# EAGLE board ecg_2017 (EAGLE 7.6.0)
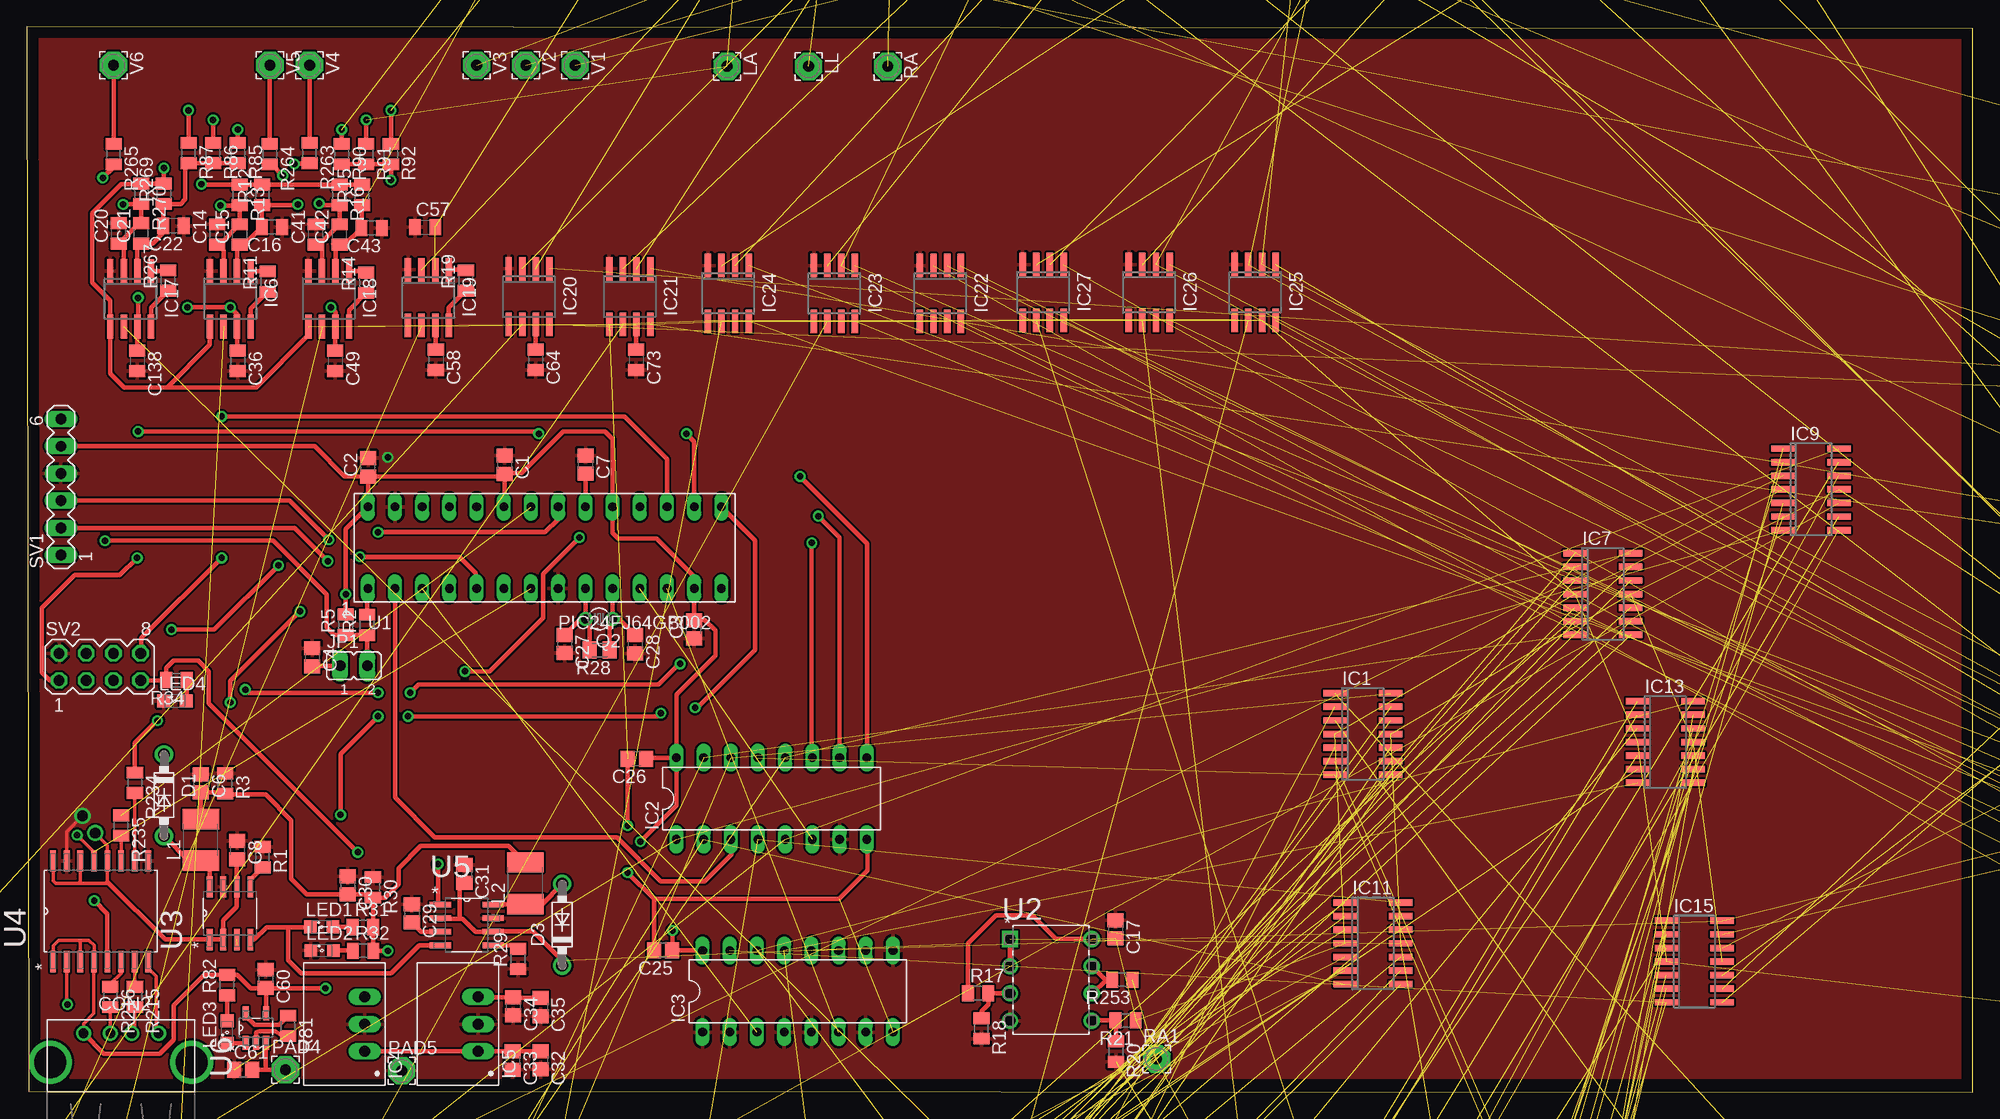
[diagram p5: board, top side]
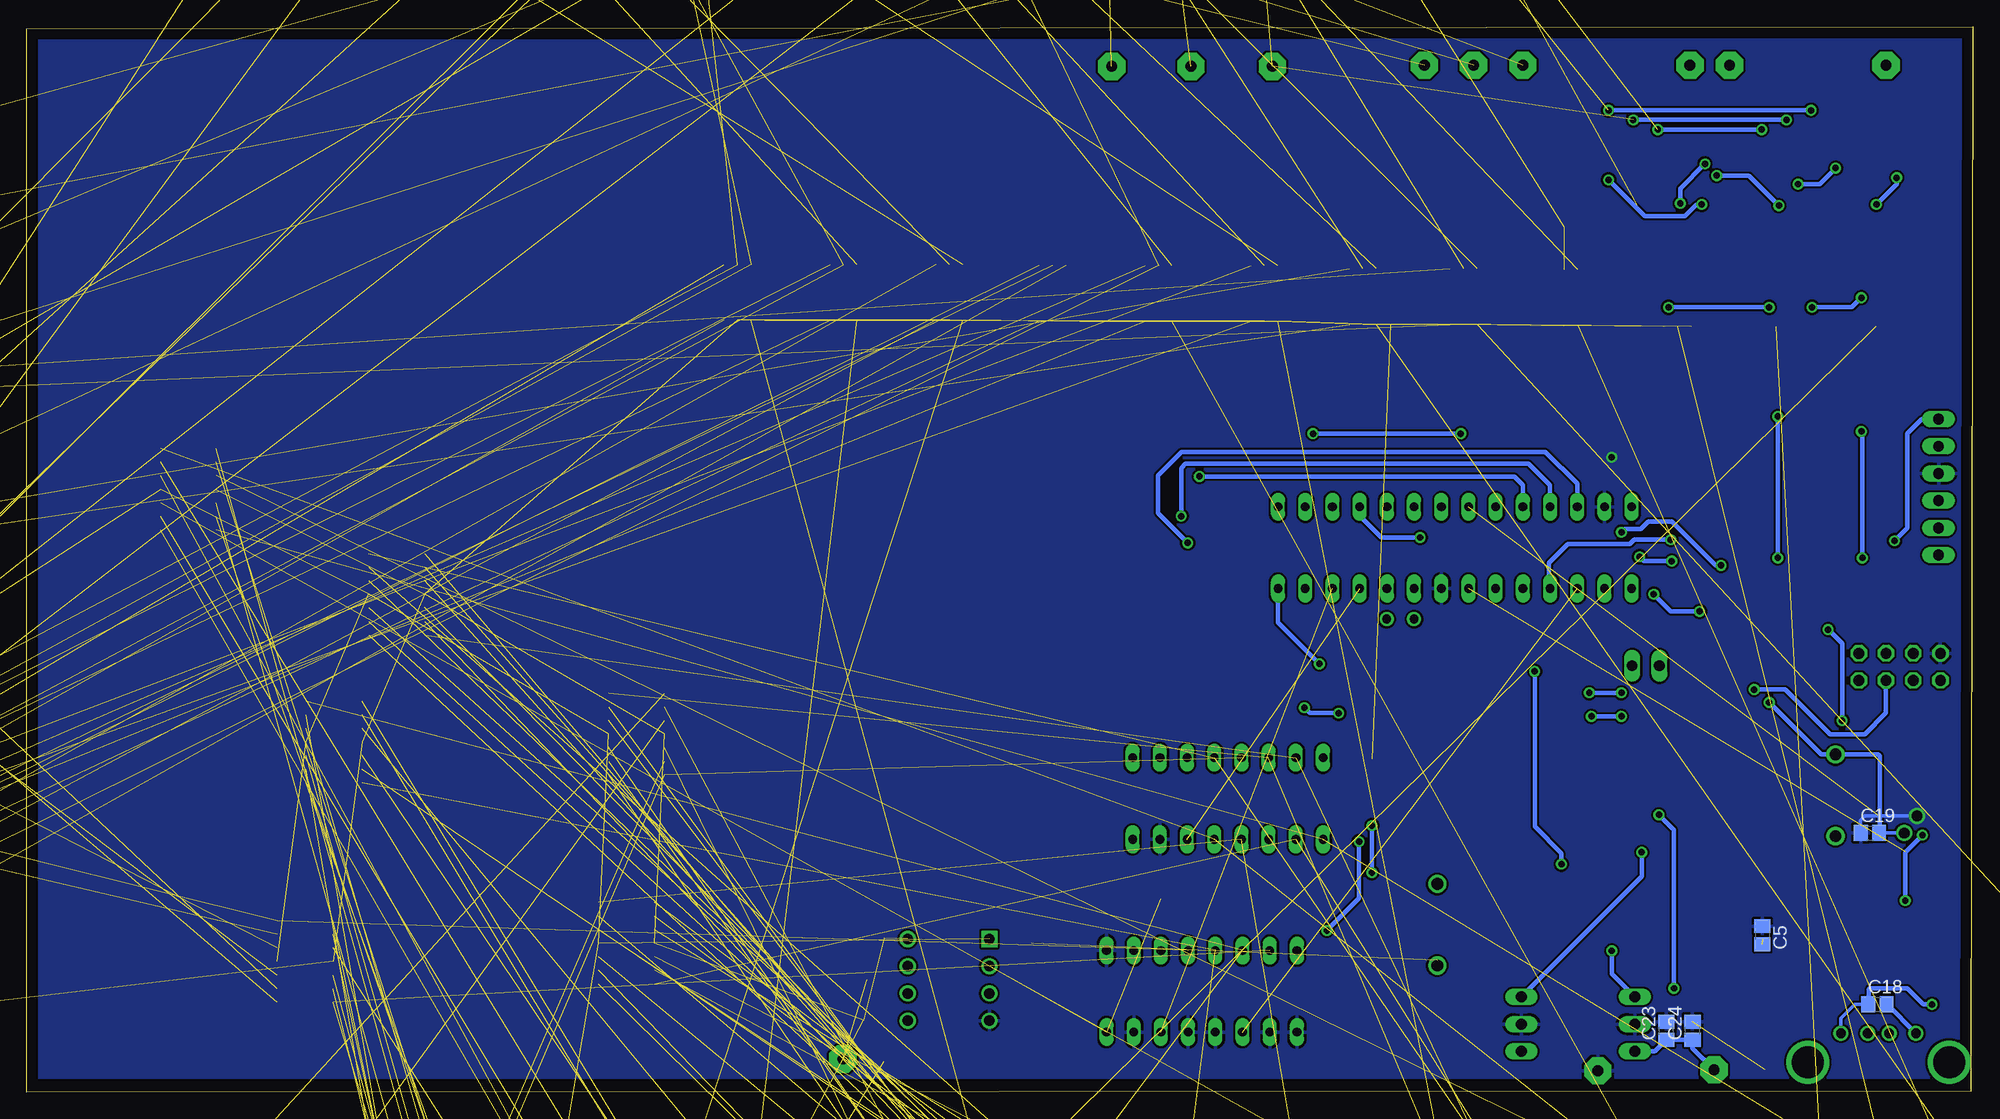
[diagram p6: board, bottom side, seen from below]

Size 181.7 x 99.5 mm. Coordinates in mm from the lower left corner, seen from the top.
Outline: 0.2,0.1 181.7,0 181.7,99.3 0,99.5 0.2,0.1
Copper layers (1*16): Top 0.035mm / dielectric 1.5mm / Bottom 0.035mm
Design rules "default": minimum track width 10mil, minimum drill 24mil, track to track 8mil, track to pad 8mil, pad to pad 8mil, via to via 8mil, smd to smd 8mil, copper to edge 40mil, drill to drill 8mil, minimum pad ring 10mil, minimum via ring 8mil, stop-mask expansion 4mil, vias tented up to drill 0mil, thermal gap 10mil

## Footprints (pad centres in the part's own frame; a part is rotated, then mirrored left to right if it is on the bottom)
C0805 = smd 1.3 x 1.5: 1 -0.85,0; 2 0.85,0
C0805' = smd 1.1 x 1.5: 1 -0.95,0; 2 0.95,0
USB-FEMALE-A-PTH = drill 0.9: D+ 5.9,1.3; D- 7.9,1.3; GND 3.4,1.3; VBUS 10.4,1.3 | drill 3: GND@1 13.5,4; GND@2 0.3,4
DO41-7.6 = drill 1.1 pad 1.7: A 3.81,0; C -3.81,0
SO14 = smd 0.6 x 2.2: 1 -3.81,-2.6; 2 -2.54,-2.6; 3 -1.27,-2.6; 4 0,-2.6; 5 1.27,-2.6; 6 2.54,-2.6; 7 3.81,-2.6; 8 3.81,2.6; 9 2.54,2.6; 10 1.27,2.6; 11 0,2.6; 12 -1.27,2.6; 13 -2.54,2.6; 14 -3.81,2.6
DIL16 = drill 0.813 long: 1 -8.89,-3.81; 2 -6.35,-3.81; 3 -3.81,-3.81; 4 -1.27,-3.81; 5 1.27,-3.81; 6 3.81,-3.81; 7 6.35,-3.81; 8 8.89,-3.81; 9 8.89,3.81; 10 6.35,3.81; 11 3.81,3.81; 12 1.27,3.81; 13 -1.27,3.81; 14 -3.81,3.81; 15 -6.35,3.81; 16 -8.89,3.81
R-78XX = drill 1.016 long: GND 0,-2.54; IN -2.54,-2.54; OUT 2.54,-2.54
SO8 = smd 0.6 x 2.2: 1 -1.905,-2.6; 2 -0.635,-2.6; 3 0.635,-2.6; 4 1.905,-2.6; 5 1.905,2.6; 6 0.635,2.6; 7 -0.635,2.6; 8 -1.905,2.6
JP2 = drill 1 long: 1 -1.27,0; 2 1.27,0
L1812 = smd 1.9 x 3.4: 1 -1.95,0; 2 1.95,0
2,54/1,0 = drill 1.016 pad 2.54 octagon: 1 0,0
SML0805 = smd 1.2 x 1.2: A 1.05,0; C -1.05,0
TC26V = drill 0.813: 1 -1.27,0; 2 1.27,0
R0805 = smd 1.1 x 1.5: 1 -0.95,0; 2 0.95,0
M0805 = smd 1.3 x 1.6: 1 -0.95,0; 2 0.95,0
MA06-1 = drill 1.016 long: 1 -6.35,0; 2 -3.81,0; 3 -1.27,0; 4 1.27,0; 5 3.81,0; 6 6.35,0
MA04-2 = drill 1.016 octagon: 1 -3.81,-1.27; 2 -3.81,1.27; 3 -1.27,-1.27; 4 -1.27,1.27; 5 1.27,-1.27; 6 1.27,1.27; 7 3.81,-1.27; 8 3.81,1.27
DIP28 = drill 0.813 long: 1 0,33.02; 2 0,30.48; 3 0,27.94; 4 0,25.4; 5 0,22.86; 6 0,20.32; 7 0,17.78; 8 0,15.24; 9 0,12.7; 10 0,10.16; 11 0,7.62; 12 0,5.08; 13 0,2.54; 14 0,0; 15 7.62,0; 16 7.62,2.54; 17 7.62,5.08; 18 7.62,7.62; 19 7.62,10.16; 20 7.62,12.7; 21 7.62,15.24; 22 7.62,17.78; 23 7.62,20.32; 24 7.62,22.86; 25 7.62,25.4; 26 7.62,27.94; 27 7.62,30.48; 28 7.62,33.02
DIP254P762X533-8 = drill 0.991 square: 1 -7.62,7.62 | drill 0.991: 2 -7.62,5.08; 3 -7.62,2.54; 4 -7.62,0; 5 0,0; 6 0,2.54; 7 0,5.08; 8 0,7.62
SOIC127P600X175-8N = smd 1.981 x 0.533: 1 -2.464,1.905; 2 -2.464,0.635; 3 -2.464,-0.635; 4 -2.464,-1.905; 5 2.464,-1.905; 6 2.464,-0.635; 7 2.464,0.635; 8 2.464,1.905
SOIC127P1032X265-16N = smd 1.981 x 0.533: 1 -4.699,4.445; 2 -4.699,3.175; 3 -4.699,1.905; 4 -4.699,0.635; 5 -4.699,-0.635; 6 -4.699,-1.905; 7 -4.699,-3.175; 8 -4.699,-4.445; 9 4.699,-4.445; 10 4.699,-3.175; 11 4.699,-1.905; 12 4.699,-0.635; 13 4.699,0.635; 14 4.699,1.905; 15 4.699,3.175; 16 4.699,4.445
SOT95P300X145-5N = smd 1.321 x 0.559: 1 -1.372,0.94; 2 -1.372,0; 3 -1.372,-0.94; 4 1.372,-0.94; 5 1.372,0.94

## Placement (x,y rotation side)
C1  100n  [C0805]  44.61,58.59 270 top
C2  100n  [C0805]  31.89,58.36 90 top
C3  100n  [C0805]  62.29,43.21 90 top
C4  100n  [C0805]  26.66,40.61 270 top
C5  100n  [C0805]  19.64,14.66 270 bottom
C6  22u  [C0805]  16.26,28.83 270 top
C7  100n  [C0805]  52.16,58.61 270 top
C8  22u  [C0805]  19.66,22.61 270 top
C9  100n  [C0805]  160.96,-81.34 270 top  (outside the outline)
C10  10u  [C0805]  167.31,-90.23 270 top  (outside the outline)
C11  10u  [C0805]  167.31,-85.15 270 top  (outside the outline)
C12  1u  [C0805]  68.59,-77.23 90 top  (outside the outline)
C13  1u  [C0805]  167.31,-74.99 270 top  (outside the outline)
C14  1n  [C0805']  17.8,80.1 90 top
C15  10n  [C0805']  19.9,80.1 90 top
C16  1n  [C0805']  22.9,80.8 180 top
C17  100n  [C0805]  101.66,15.21 270 top
C18  100n  [C0805]  8.9,8.2 0 bottom
C19  100n  [C0805]  9.6,24.2 0 bottom
C20  1n  [C0805']  8.6,80.2 90 top
C21  10n  [C0805']  10.7,80.2 90 top
C22  1n  [C0805']  13.7,80.9 180 top
C23  10u  [C0805]  28.61,5.73 90 bottom
C24  100n  [C0805]  26.16,5.74 90 bottom
C25  100n  [C0805]  59.41,13.24 180 top
C26  100n  [C0805]  56.96,31.14 180 top
C27  22p  [C0805]  50.21,41.85 270 top
C28  22p  [C0805]  56.81,41.83 270 top
C29  100n  [C0805]  35.96,16.71 270 top
C30  22u  [C0805]  29.96,19.31 270 top
C31  22u  [C0805]  40.86,20.39 270 top
C32  10u  [C0805]  47.96,2.97 270 top
C33  100n  [C0805]  45.36,2.96 270 top
C34  100n  [C0805]  45.41,8.01 270 top
C35  10u  [C0805]  47.96,7.95 270 top
C36  100n  [C0805']  19.7,68.3 270 top
C37  10u  [C0805]  6.67,-142.27 270 top  (outside the outline)
C38  10u  [C0805]  6.67,-147.35 270 top  (outside the outline)
C39  1u  [C0805]  6.67,-152.43 270 top  (outside the outline)
C40  1u  [C0805]  6.67,-157.51 270 top  (outside the outline)
C41  1n  [C0805']  27,80.1 90 top
C42  10n  [C0805']  29.2,80.1 90 top
C43  1n  [C0805']  32.2,80.7 180 top
C44  100n  [C0805]  -16.19,-163.86 270 top  (outside the outline)
C45  10u  [C0805]  -26.35,-142.27 270 top  (outside the outline)
C46  10u  [C0805]  -26.35,-147.35 270 top  (outside the outline)
C47  1u  [C0805]  -26.35,-152.43 270 top  (outside the outline)
C48  1u  [C0805]  -26.35,-157.51 270 top  (outside the outline)
C49  100n  [C0805']  28.8,68.3 270 top
C50  1n  [C0805']  253.6,70.6 0 top  (outside the outline)
C51  10n  [C0805']  258.4,70.6 0 top  (outside the outline)
C53  10u  [C0805]  -59.37,-142.27 270 top  (outside the outline)
C54  10u  [C0805]  -59.37,-147.35 270 top  (outside the outline)
C55  1u  [C0805]  -59.37,-152.43 270 top  (outside the outline)
C56  1u  [C0805]  -59.37,-157.51 270 top  (outside the outline)
C57  1n  [C0805']  37.2,80.8 0 top
C58  100n  [C0805']  38.2,68.4 270 top
C59  1n  [C0805']  253.6,50.1 0 top  (outside the outline)
C60  4u7  [C0805]  22.3,10.6 270 top
C61  4u7  [C0805]  20.2,2.1 0 top
C62  10n  [C0805']  258.4,50.1 0 top  (outside the outline)
C63  1n  [C0805']  248.6,46.2 0 top  (outside the outline)
C64  100n  [C0805']  47.5,68.4 270 top
C65  1n  [C0805']  253.6,29.6 0 top  (outside the outline)
C66  100n  [C0805]  131.9,-94.9 270 top  (outside the outline)
C67  10u  [C0805]  -70.5,-59 90 top  (outside the outline)
C68  10u  [C0805]  -70.5,-54.3 90 top  (outside the outline)
C69  1u  [C0805]  -70.5,-49.6 90 top  (outside the outline)
C70  1u  [C0805]  -70.5,-44.9 90 top  (outside the outline)
C71  10n  [C0805']  258.4,29.6 0 top  (outside the outline)
C72  1n  [C0805']  248.6,25.7 0 top  (outside the outline)
C73  100n  [C0805']  56.9,68.4 270 top
C74  1n  [C0805']  278.6,-11.4 0 top  (outside the outline)
C76  10u  [C0805]  -33.3,-59 90 top  (outside the outline)
C77  10u  [C0805]  -33.3,-54.3 90 top  (outside the outline)
C78  1u  [C0805]  -33.3,-49.6 90 top  (outside the outline)
C79  1u  [C0805]  -33.3,-44.9 90 top  (outside the outline)
C80  10n  [C0805']  248.6,-15.3 0 top  (outside the outline)
C81  1n  [C0805']  253.4,-15.3 0 top  (outside the outline)
C82  100n  [C0805']  268.6,-11.4 0 top  (outside the outline)
C83  1n  [C0805']  258.2,-15.3 0 top  (outside the outline)
C84  100n  [C0805]  57.5,-94.9 270 top  (outside the outline)
C85  10u  [C0805]  3.9,-59 90 top  (outside the outline)
C86  10u  [C0805]  3.9,-54.3 90 top  (outside the outline)
C87  1u  [C0805]  3.9,-49.6 90 top  (outside the outline)
C88  1u  [C0805]  3.9,-44.9 90 top  (outside the outline)
C89  10n  [C0805']  263,-15.3 0 top  (outside the outline)
C90  1n  [C0805']  267.8,-15.3 0 top  (outside the outline)
C91  100n  [C0805']  273.6,-11.4 0 top  (outside the outline)
C92  1n  [C0805']  272.6,-15.3 0 top  (outside the outline)
C94  10u  [C0805]  41.1,-53.2 90 top  (outside the outline)
C95  10u  [C0805]  41.1,-48.5 90 top  (outside the outline)
C96  1u  [C0805]  41.1,-43.8 90 top  (outside the outline)
C97  1u  [C0805]  14.7,-94.9 270 top  (outside the outline)
C98  10n  [C0805']  277.4,-15.3 0 top  (outside the outline)
C99  1n  [C0805']  248.6,-19.2 0 top  (outside the outline)
C100  100n  [C0805']  278.3,13 0 top  (outside the outline)
C101  1n  [C0805']  248.6,4.2 0 top  (outside the outline)
C102  100n  [C0805]  -12.7,-109.7 270 top  (outside the outline)
C103  10u  [C0805]  -16.9,-100.6 270 top  (outside the outline)
C104  10u  [C0805]  78.3,-58.8 90 top  (outside the outline)
C105  1u  [C0805]  78.3,-53.1 90 top  (outside the outline)
C106  1u  [C0805]  78.3,-47.4 90 top  (outside the outline)
C107  10n  [C0805']  254.4,4.2 0 top  (outside the outline)
C108  1n  [C0805']  260.2,4.2 0 top  (outside the outline)
C109  100n  [C0805']  266,4.2 0 top  (outside the outline)
C110  1n  [C0805']  271.8,4.2 0 top  (outside the outline)
C112  10u  [C0805]  115.5,-27.8 90 top  (outside the outline)
C113  10u  [C0805]  115.5,-22.1 90 top  (outside the outline)
C114  1u  [C0805]  125.7,-70.2 90 top  (outside the outline)
C115  1u  [C0805]  125.7,-64.5 90 top  (outside the outline)
C116  10n  [C0805']  277.6,4.2 0 top  (outside the outline)
C117  1n  [C0805']  248.6,0.3 0 top  (outside the outline)
C118  100n  [C0805']  254.4,0.3 0 top  (outside the outline)
C119  1n  [C0805']  260.2,0.3 0 top  (outside the outline)
C120  100n  [C0805]  125.7,-36 90 top  (outside the outline)
C121  10u  [C0805]  125.7,-30.3 90 top  (outside the outline)
C122  10u  [C0805]  125.7,-24.6 90 top  (outside the outline)
C123  1u  [C0805]  131.3,-70.2 90 top  (outside the outline)
C124  1u  [C0805]  131.3,-64.5 90 top  (outside the outline)
C125  10n  [C0805']  266,0.3 0 top  (outside the outline)
C126  1n  [C0805']  271.8,0.3 0 top  (outside the outline)
C127  100n  [C0805']  277.6,0.3 0 top  (outside the outline)
C128  1n  [C0805']  248.6,-31.9 0 top  (outside the outline)
C130  10u  [C0805]  188.8,34.6 0 top  (outside the outline)
C131  10u  [C0805]  187.9,37.9 270 top  (outside the outline)
C132  1u  [C0805]  201.9,32.1 0 top  (outside the outline)
C133  1u  [C0805]  192,26.8 0 top  (outside the outline)
C134  10n  [C0805']  254.4,-31.9 0 top  (outside the outline)
C135  1n  [C0805']  248.6,-35.8 0 top  (outside the outline)
C136  100n  [C0805']  254.4,-35.8 0 top  (outside the outline)
C138  100n  [C0805']  10.3,68.3 270 top
CON2  USB  [USB-FEMALE-A-PTH]  15.7,6.8 180 top
D1  1N5817-B  [DO41-7.6]  12.81,27.73 270 top
D3  1N5817-B  [DO41-7.6]  49.99,15.64 90 top
IC1  ICL7641D  [SO14]  124.75,33.45 270 top
IC2  4051N  [DIL16]  69.55,27.42 0 top
IC3  4051N  [DIL16]  71.99,9.42 0 top
IC4  [R-78XX]  29.01,6.35 90 top
IC5  [R-78XX]  39.61,6.35 90 top
IC6  AD623R  [SO8]  19,74.1 180 top
IC7  ICL7641D  [SO14]  147.17,46.52 270 top
IC9  ICL7641D  [SO14]  166.6,56.3 270 top
IC11  ICL7641D  [SO14]  125.7,13.9 270 top
IC13  ICL7641D  [SO14]  153,32.7 270 top
IC15  ICL7641D  [SO14]  155.7,12.2 270 top
IC17  AD623R  [SO8]  9.7,74.1 180 top
IC18  AD623R  [SO8]  28.2,74.1 180 top
IC19  AD623R  [SO8]  37.5,74.2 180 top
IC20  AD623R  [SO8]  46.9,74.3 180 top
IC21  AD623R  [SO8]  56.3,74.3 180 top
IC22  AD623R  [SO8]  85.3,74.6 180 top
IC23  AD623R  [SO8]  75.4,74.6 180 top
IC24  AD623R  [SO8]  65.5,74.6 180 top
IC25  AD623R  [SO8]  114.7,74.7 180 top
IC26  AD623R  [SO8]  104.8,74.7 180 top
IC27  AD623R  [SO8]  94.9,74.7 180 top
IC28  AD623R  [SO8]  251.3,-25.3 0 top  (outside the outline)
JP1  JMP2  [JP2]  30.53,39.82 0 top
L1  47u  [L1812]  16.25,23.56 90 top
L2  47u  [L1812]  46.55,19.51 90 top
LA  [2,54/1,0]  65.4,95.8 270 top
LED1  [SML0805]  27.53,15.43 0 top
LED2  [SML0805]  27.58,13.23 0 top
LED3  [SML0805]  18.7,5.6 90 top
LED4  [SML0805]  13.83,36.53 0 top
LL  [2,54/1,0]  73,95.8 270 top
PAD4  [2,54/1,0]  24.15,2.09 0 top
PAD5  [2,54/1,0]  35,1.99 0 top
Q2  40MHz  [TC26V]  53.44,44.19 180 top
R1  100k  [R0805]  22.02,21.95 270 top
R2  330  [R0805]  31.78,43.63 90 top
R3  100k  [R0805]  18.52,28.83 270 top
R4  330k  [R0805]  183.82,-49.59 270 top  (outside the outline)
R5  10k  [R0805]  29.78,43.65 90 top
R6  330k  [R0805]  183.82,-44.51 270 top  (outside the outline)
R7  1k1  [R0805]  183.82,-29.27 270 top  (outside the outline)
R8  1k1  [R0805]  188.9,-101.66 270 top  (outside the outline)
R9  1k  [R0805]  188.9,-96.58 270 top  (outside the outline)
R10  250  [R0805]  178.74,-100.39 270 top  (outside the outline)
R11  11k  [R0805]  22.5,75.7 90 top
R12  1M  [R0805]  22,83.8 90 top
R13  1M  [R0805]  19.9,83.8 270 top
R14  11k  [R0805]  31.7,75.6 90 top
R15  1M  [R0805]  31.3,83.8 90 top
R16  1M  [R0805]  29.2,83.8 270 top
R17  82k  [R0805]  88.83,9.24 0 top
R18  68k  [R0805]  89.14,5.95 270 top
R19  11k  [R0805]  41,75.8 90 top
R20  68k  [R0805]  101.7,3.8 270 top
R21  82k  [R0805]  102.6,6.7 180 top
R22  1M  [R0805]  248.6,74.5 0 top  (outside the outline)
R23  1M  [R0805]  253.6,74.5 0 top  (outside the outline)
R24  11k  [R0805]  258.5,62.8 0 top  (outside the outline)
R25  1M  [R0805]  248.6,54 0 top  (outside the outline)
R26  1M  [R0805]  253.6,54 0 top  (outside the outline)
R27  11k  [R0805]  258.5,42.3 0 top  (outside the outline)
R28  10M  [M0805]  53.49,41.29 180 top
R29  100k  [R0805]  45.88,12.45 90 top
R30  100k  [R0805]  32.32,19.13 270 top
R31  1k  [R0805]  31.39,15.42 0 top
R32  500  [R0805]  31.41,13.22 0 top
R33  1k  [R0805]  26.99,-142.27 270 top  (outside the outline)
R34  500  [R0805]  13.97,38.48 180 top
R35  16k  [R0805]  21.91,-142.27 270 top  (outside the outline)
R36  330k  [R0805]  0.32,-153.7 270 top  (outside the outline)
R37  330k  [R0805]  0.32,-158.78 270 top  (outside the outline)
R38  1k1  [R0805]  0.32,-163.86 270 top  (outside the outline)
R39  1k1  [R0805]  -6.03,-142.27 270 top  (outside the outline)
R40  1M  [R0805]  248.6,33.5 0 top  (outside the outline)
R41  1M  [R0805]  253.6,33.5 0 top  (outside the outline)
R42  11k  [R0805]  248.6,-3.6 0 top  (outside the outline)
R43  1M  [R0805]  253.6,-3.6 0 top  (outside the outline)
R44  1M  [R0805]  258.6,-3.6 0 top  (outside the outline)
R45  11k  [R0805]  263.6,-3.6 0 top  (outside the outline)
R46  1M  [R0805]  268.6,-3.6 0 top  (outside the outline)
R47  1k  [R0805]  -11.11,-152.43 270 top  (outside the outline)
R48  250  [R0805]  -11.11,-157.51 270 top  (outside the outline)
R49  1k  [R0805]  -11.11,-162.59 270 top  (outside the outline)
R50  16k  [R0805]  -11.11,-167.67 270 top  (outside the outline)
R51  330k  [R0805]  -32.7,-153.7 270 top  (outside the outline)
R52  330k  [R0805]  -32.7,-158.78 270 top  (outside the outline)
R53  1k1  [R0805]  -32.7,-163.86 270 top  (outside the outline)
R54  1k1  [R0805]  -39.05,-142.27 270 top  (outside the outline)
R55  1M  [R0805]  273.6,-3.6 0 top  (outside the outline)
R56  11k  [R0805]  278.6,-3.6 0 top  (outside the outline)
R57  1M  [R0805]  248.6,-7.5 0 top  (outside the outline)
R58  1M  [R0805]  253.6,-7.5 0 top  (outside the outline)
R59  11k  [R0805]  258.6,-7.5 0 top  (outside the outline)
R60  1M  [R0805]  263.6,-7.5 0 top  (outside the outline)
R61  1M  [R0805]  268.6,-7.5 0 top  (outside the outline)
R62  1k  [R0805]  -44.13,-152.43 270 top  (outside the outline)
R63  250  [R0805]  -44.13,-157.51 270 top  (outside the outline)
R64  1k  [R0805]  -44.13,-162.59 270 top  (outside the outline)
R65  16k  [R0805]  -44.13,-167.67 270 top  (outside the outline)
R66  330k  [R0805]  -65.72,-153.7 270 top  (outside the outline)
R67  330k  [R0805]  -65.72,-158.78 270 top  (outside the outline)
R68  1k1  [R0805]  -65.72,-163.86 270 top  (outside the outline)
R69  1k1  [R0805]  -72.07,-142.27 270 top  (outside the outline)
R70  11k  [R0805]  273.6,-7.5 0 top  (outside the outline)
R71  1M  [R0805]  278.6,-7.5 0 top  (outside the outline)
R72  1M  [R0805]  248.6,-11.4 0 top  (outside the outline)
R73  11k  [R0805]  253.6,-11.4 0 top  (outside the outline)
R74  1M  [R0805]  258.6,-11.4 0 top  (outside the outline)
R75  1M  [R0805]  263.6,-11.4 0 top  (outside the outline)
R76  11k  [R0805]  248.6,-39.7 0 top  (outside the outline)
R77  1k  [R0805]  -77.15,-152.43 270 top  (outside the outline)
R78  250  [R0805]  -77.15,-157.51 270 top  (outside the outline)
R79  1k  [R0805]  -77.15,-162.59 270 top  (outside the outline)
R80  16k  [R0805]  -77.15,-167.67 270 top  (outside the outline)
R81  2k  [R0805]  24.4,6.2 270 top
R82  500  [R0805]  18.7,10 90 top
R83  1M  [R0805]  253.6,-39.7 0 top  (outside the outline)
R84  1M  [R0805]  258.6,-39.7 0 top  (outside the outline)
R85  330k  [R0805]  19.7,87.7 270 top
R86  330k  [R0805]  17.4,87.7 270 top
R87  330k  [R0805]  15.1,87.7 270 top
R90  330k  [R0805]  29.4,87.6 270 top
R91  330k  [R0805]  31.7,87.6 270 top
R92  330k  [R0805]  34,87.6 270 top
R95  330k  [R0805]  54.1,123.2 90 top  (outside the outline)
R96  330k  [R0805]  56.3,123.2 90 top  (outside the outline)
R97  330k  [R0805]  58.5,123.2 90 top  (outside the outline)
R100  330k  [R0805]  65.4,123.2 90 top  (outside the outline)
R101  330k  [R0805]  67.6,123.2 90 top  (outside the outline)
R102  330k  [R0805]  69.8,123.2 90 top  (outside the outline)
R103  330k  [R0805]  -64.9,-56 90 top  (outside the outline)
R104  330k  [R0805]  -64.9,-50 90 top  (outside the outline)
R105  1k1  [R0805]  120.7,-95.1 270 top  (outside the outline)
R106  1k1  [R0805]  120.7,-101.1 270 top  (outside the outline)
R114  1k  [R0805]  -55.4,-46 90 top  (outside the outline)
R115  250  [R0805]  112.9,-95.1 270 top  (outside the outline)
R116  1k  [R0805]  112.9,-101.1 270 top  (outside the outline)
R117  16k  [R0805]  -51.5,-58 90 top  (outside the outline)
R120  330k  [R0805]  76.3,123.2 90 top  (outside the outline)
R121  330k  [R0805]  78.6,123.2 90 top  (outside the outline)
R122  330k  [R0805]  81,123.2 90 top  (outside the outline)
R123  330k  [R0805]  -27.7,-56 90 top  (outside the outline)
R124  330k  [R0805]  -27.7,-50 90 top  (outside the outline)
R125  1k1  [R0805]  83.5,-95.1 270 top  (outside the outline)
R126  1k1  [R0805]  83.5,-101.1 270 top  (outside the outline)
R134  1k  [R0805]  -18.2,-46 90 top  (outside the outline)
R135  250  [R0805]  75.7,-95.1 270 top  (outside the outline)
R136  1k  [R0805]  75.7,-101.1 270 top  (outside the outline)
R137  16k  [R0805]  -14.3,-58 90 top  (outside the outline)
R140  330k  [R0805]  87.3,123.2 90 top  (outside the outline)
R141  330k  [R0805]  89.7,123.2 90 top  (outside the outline)
R142  330k  [R0805]  92,123.2 90 top  (outside the outline)
R143  330k  [R0805]  9.5,-56 90 top  (outside the outline)
R144  330k  [R0805]  9.5,-50 90 top  (outside the outline)
R145  1k1  [R0805]  46.3,-95.1 270 top  (outside the outline)
R146  1k1  [R0805]  46.3,-101.1 270 top  (outside the outline)
R154  1k  [R0805]  19,-46 90 top  (outside the outline)
R155  250  [R0805]  38.5,-95.1 270 top  (outside the outline)
R156  1k  [R0805]  38.5,-101.1 270 top  (outside the outline)
R157  16k  [R0805]  22.9,-58 90 top  (outside the outline)
R160  330k  [R0805]  98.5,123.2 90 top  (outside the outline)
R161  330k  [R0805]  100.9,123.2 90 top  (outside the outline)
R162  330k  [R0805]  46.7,-56 90 top  (outside the outline)
R163  330k  [R0805]  46.7,-50 90 top  (outside the outline)
R164  1k1  [R0805]  9.1,-95.1 270 top  (outside the outline)
R165  1k1  [R0805]  9.1,-101.1 270 top  (outside the outline)
R173  1k  [R0805]  56.2,-46 90 top  (outside the outline)
R174  250  [R0805]  1.3,-95.1 270 top  (outside the outline)
R175  1k  [R0805]  1.3,-101.1 270 top  (outside the outline)
R176  16k  [R0805]  60.1,-58 90 top  (outside the outline)
R179  330k  [R0805]  112,123.2 90 top  (outside the outline)
R180  330k  [R0805]  109.7,123.2 90 top  (outside the outline)
R181  330k  [R0805]  83.9,-47.3 90 top  (outside the outline)
R182  330k  [R0805]  -28.1,-95.1 270 top  (outside the outline)
R183  1k1  [R0805]  -28.1,-101.1 270 top  (outside the outline)
R184  1k1  [R0805]  89.5,-58 90 top  (outside the outline)
R192  1k  [R0805]  -35.9,-95.1 270 top  (outside the outline)
R193  250  [R0805]  -35.9,-101.1 270 top  (outside the outline)
R194  1k  [R0805]  97.3,-58 90 top  (outside the outline)
R195  16k  [R0805]  97.3,-52 90 top  (outside the outline)
R198  330k  [R0805]  120.4,123.2 90 top  (outside the outline)
R199  330k  [R0805]  122.8,123.2 90 top  (outside the outline)
R200  330k  [R0805]  136.9,-35.9 90 top  (outside the outline)
R201  330k  [R0805]  136.9,-29.9 90 top  (outside the outline)
R202  1k1  [R0805]  136.9,-23.9 90 top  (outside the outline)
R203  1k1  [R0805]  132.8,-118.5 270 top  (outside the outline)
R211  1k  [R0805]  132.8,-166.5 270 top  (outside the outline)
R212  250  [R0805]  128.9,-118.5 270 top  (outside the outline)
R213  1k  [R0805]  128.9,-124.5 270 top  (outside the outline)
R214  16k  [R0805]  128.9,-130.5 270 top  (outside the outline)
R215  24  [R0805]  10.1,8.9 270 top
R216  24  [R0805]  7.8,8.9 270 top
R217  330k  [R0805]  131,123.2 90 top  (outside the outline)
R218  330k  [R0805]  131.1,105.9 90 top  (outside the outline)
R219  330k  [R0805]  128.9,-160.5 270 top  (outside the outline)
R220  330k  [R0805]  128.9,-166.5 270 top  (outside the outline)
R221  1k1  [R0805]  125,-118.5 270 top  (outside the outline)
R222  1k1  [R0805]  125,-124.5 270 top  (outside the outline)
R230  1k  [R0805]  121.1,-118.5 270 top  (outside the outline)
R231  250  [R0805]  121.1,-124.5 270 top  (outside the outline)
R232  1k  [R0805]  121.1,-130.5 270 top  (outside the outline)
R233  16k  [R0805]  121.1,-136.5 270 top  (outside the outline)
R234  24  [R0805]  10.1,28.9 270 top
R235  24  [R0805]  8.8,24.9 270 top
R236  330k  [R0805]  141.5,123.3 90 top  (outside the outline)
R237  330k  [R0805]  141.6,105.9 90 top  (outside the outline)
R238  330k  [R0805]  192,40.1 0 top  (outside the outline)
R239  330k  [R0805]  192,38 180 top  (outside the outline)
R240  1k1  [R0805]  195.9,42.2 180 top  (outside the outline)
R241  1k1  [R0805]  188.7,29.6 180 top  (outside the outline)
R249  1k  [R0805]  191.9,24.6 180 top  (outside the outline)
R250  250  [R0805]  190.1,21.2 270 top  (outside the outline)
R251  1k  [R0805]  192,42.2 0 top  (outside the outline)
R252  16k  [R0805]  195.9,40.1 180 top  (outside the outline)
R253  330k  [R0805]  102.3,10.5 180 top
R255  330k  [R0805]  152.9,123.3 90 top  (outside the outline)
R256  330k  [R0805]  152.9,105.6 90 top  (outside the outline)
R257  330k  [R0805]  120.5,105.9 90 top  (outside the outline)
R258  330k  [R0805]  109.7,105.9 90 top  (outside the outline)
R259  330k  [R0805]  98.5,105.8 90 top  (outside the outline)
R260  330k  [R0805]  87.3,105.9 90 top  (outside the outline)
R261  330k  [R0805]  76.3,105.9 90 top  (outside the outline)
R262  330k  [R0805]  65.4,105.9 90 top  (outside the outline)
R263  330k  [R0805]  26.4,87.7 270 top
R264  330k  [R0805]  22.7,87.6 270 top
R265  330k  [R0805]  8.1,87.6 270 top
R267  11k  [R0805]  13.2,75.8 90 top
R269  1M  [R0805]  12.8,83.9 90 top
R270  1M  [R0805]  10.7,83.9 270 top
RA  [2,54/1,0]  80.4,95.8 270 top
RA1  [2,54/1,0]  105.5,3.1 0 top
SV1  [MA06-1]  3.19,56.51 90 top
SV2  [MA04-2]  6.82,39.72 0 top
U1  PIC24FJ64GB002  [DIP28]  64.86,47.04 90 top
U2  MCP6002-I/P  [DIP254P762X533-8]  99.44,6.68 0 top
U3  MAX856CSA+  [SOIC127P600X175-8N]  18.98,16.72 90 top
U4  ADUM3160BRWZ  [SOIC127P1032X265-16N]  6.9,16.9 90 top
U5  MAX856CSA+  [SOIC127P600X175-8N]  41.09,15.62 0 top
U6  MCP73832T-2DCI/OT  [SOT95P300X145-5N]  21.4,6 90 top
V1  [2,54/1,0]  51.2,95.9 270 top
V2  [2,54/1,0]  46.6,95.9 270 top
V3  [2,54/1,0]  42,95.9 270 top
V4  [2,54/1,0]  26.4,95.9 270 top
V5  [2,54/1,0]  22.7,95.9 270 top
V6  [2,54/1,0]  8.1,95.9 270 top

## Tracks (layer width: path | path; a pad name or v marks a point on that pad's centre or on a via)
+3V3  (via drill 0.6, 1)
  Top 0.305: U4.16 2.46,19.75 2.7,19.5 4.8,19.5 | 4.8,19.5 5,19.7 U4.14 | 4.8,19.5 7.4,19.5 7.54,19.64 U4.12 7.54,23.07 v6.4,24.2
  Top 0.406: C8.2 19.61,21.71 U3.6 19.6,19.17 19.6,17.3 18.34,16.05 U3.2 U3.1 12.91,14.26 7.54,19.64 | 31.89,57.19 C2.1 29.7,57.5 26.88,60.32 SV1.5 | C1.2 44.61,54.73 U1.23 | R5.2 v29.78,46.5 29.78,52.6 U1.28 31.89,54.71 31.89,57.19 | 31.89,57.19 32.2,57.5 44.37,57.5 C1.2 | C1.2 44.67,57.8 46.2,57.8 50.1,61.7 54,61.7 54.7,61 U1.19 54.7,52.2 55.2,51.7 58.8,51.7 62.32,48.18 U1.13 62.29,47.01 C3.2 62.33,44.1 63.3,44.1 64.3,43.1 64.3,40.8 60.66,37.16 IC2.16 | v19,36.4 19,38.4 v25.5,44.9 | IC2.16 57.9,31.23 C26.1 | IC3.16 C25.1 60.3,13.28 v60.3,15.1 | IC2.16 60.66,26.76 v57.3,23.4
  Bottom 0.305: v6.4,24.2 C19.2
  Bottom 0.406: C19.2 8.7,24.25 8.7,31.4 8.84,31.54 D1.C 14.14,31.54 v19,36.4 | v25.5,44.9 28.18,44.9 v29.78,46.5 | v57.3,23.4 57.3,18.1 v60.3,15.1
ADUM_SPEED  (via drill 0.6)  (1 unrouted)
  Top 0.305: U4.13 6.27,22.44 5,23.7
  Top 0.406: U4.5 7.54,16.67 v6.3,17.9 | v4.7,24 5,23.7
  Bottom 0.406: v6.3,17.9 6.3,22.4 v4.7,24
D+  (via drill 0.6)
  Top 0.406: R234.1 10.1,32.6 v12.2,34.7 | v13.5,43.2 17.5,43.2 v23.5,49.2 | v32.8,52.3 48.4,52.3 49.6,53.5 49.6,54.64 U1.21
  Bottom 0.406: v12.2,34.7 12.2,41.9 v13.5,43.2 | v23.5,49.2 24,49.2 28.1,53.3 30.3,53.3 31,52.6 32.5,52.6 v32.8,52.3
D-  (1 unrouted)
DGND  (via drill 0.6, 1)  (34 unrouted)
  Top 0.305: U4.15 3.73,24.33 v5.2,25.8
  Bottom 0.305: v5.2,25.8 10.1,25.8 10.5,25.4 10.5,24.25 C19.1
  other vias: 33.7,59.3
  pour Bottom: 0.9,98.5 0.9,1.4 180.8,1.4 180.8,98.7 0.9,98.7
  pour Top: 0.9,98.7 0.9,1.4 180.8,1.4 180.8,98.7
ECG_MUX_1
  Top 0.406: U1.2 34.38,27.52 38.1,23.8 55.1,23.8 59.2,19.7 63.3,19.7 65.8,22.2 65.8,23.55 IC2.3
ECG_MUX_2  (1 unrouted)
ECG_OUT_1  (3 unrouted)
ECG_OUT_2  (3 unrouted)
ECG_OUT_3  (3 unrouted)
ECG_OUT_4  (3 unrouted)
ECG_OUT_5  (3 unrouted)
ECG_OUT_6  (3 unrouted)
ECG_OUT_7  (3 unrouted)
ECG_OUT_8  (3 unrouted)
ECG_OUT_9  (3 unrouted)
ECG_OUT_10  (3 unrouted)
ECG_OUT_11  (3 unrouted)
ECG_OUT_12  (3 unrouted)
ECG_VREF  (via drill 0.6)  (87 unrouted)
  Top 0.406: U2.2 U2.1 | C25.2 58.56,18.04 | 58.56,18.04 v56.1,20.5 | v56.1,24.9 C26.2 | 58.56,18.04 75.84,18.04 78.5,20.7 78.5,23.55 IC2.8 | 13.1,65.8 9.1,65.8 7.79,67.1 IC17.5 7.79,73.91 6.1,75.6 6.1,82.1 8.8,84.8 10.65,84.8 R270.1 R269.2 v12.8,86.3 | 13.1,65.8 17.1,69.8 IC6.5 | v16.3,84.8 16.35,84.75 R13.1 R12.2 R16.1 R15.2 | IC18.5 26.29,70.69 21.4,65.8 13.1,65.8
  Bottom 0.406: v56.1,20.5 v56.1,24.9 | v16.3,84.8 14.3,84.8 v12.8,86.3
LA  (via drill 0.6)  (10 unrouted)
  Top 0.406: R86.1 v17.4,90.8 | v31.7,90.8 R91.1
  Bottom 0.406: v17.4,90.8 v31.7,90.8
LL  (via drill 0.6)  (10 unrouted)
  Top 0.406: R85.1 v19.7,89.9 | v29.4,89.9 R90.1
  Bottom 0.406: v19.7,89.9 v29.4,89.9
LO_BATT
  Top 0.406: U3.4 21.26,14.26 22.4,15.4 24.5,15.4 | 24.5,15.4 26.45,15.4 LED1.C | U5.4 36.62,13.71 34,11.1 25.6,11.1 24.4,12.3 24.4,15.3 24.5,15.4
MCLR  (via drill 0.6)
  Top 0.406: JP1.2 31.78,39.84 R2.1 31.76,42.7 R5.1 28.7,42.7 28,43.4 28,46.5 23,51.5 v7.3,51.5
  Bottom 0.406: SV1.6 4.74,62.86 6.1,61.5 6.1,52.7 v7.3,51.5
MUX_A  (via drill 0.6)
  Top 0.406: v73.3,51.3 73.3,31.29 IC2.11
  Bottom 0.406: U1.26 36.92,56.82 39.9,59.8 73.9,59.8 76.1,57.6 76.1,54.1 v73.3,51.3
MUX_B  (via drill 0.6)
  Top 0.406: IC2.10 75.9,51.8 v73.9,53.8
  Bottom 0.406: v73.9,53.8 73.9,58.3 73.5,58.7 41.5,58.7 39.5,56.7 39.5,54.7 U1.25
MUX_C  (via drill 0.6)
  Top 0.406: IC2.9 78.44,51.26 v72.2,57.5
  Bottom 0.406: v72.2,57.5 42.8,57.5 42,56.7 U1.24
MUX_INH_1  (1 unrouted)
MUX_INH_2  (1 unrouted)
N$1  (1 unrouted)
N$2
  Top 0.406: U3.5 20.88,19.87 R1.2
N$3  (2 unrouted)
N$4
  Top 0.406: U3.8 17.07,20.79 L1.1 15.12,21.61 D1.A
N$5  (2 unrouted)
N$6  (2 unrouted)
N$7  (2 unrouted)
N$8  (2 unrouted)
N$9
  Top 0.406: IC6.8 20.9,73.16 R11.1
N$10
  Top 0.406: JP1.1 26.72,39.82 C4.2
N$11
  Top 0.406: R2.2 31.78,46.98 U1.1
N$12
  Top 0.406: IC6.1 22.45,76.7 R11.2
N$13  (4 unrouted)
N$14  (via drill 0.6)
  Top 0.406: IC6.3 18.36,78.58 C14.1 18,79.15 C15.2 R13.2 19.85,82.8 v18.1,82.8 | R264.2 22.85,86.65 v23.9,85.6
  Bottom 0.406: v23.9,85.6 20.9,85.6 v18.1,82.8
N$15  (1 unrouted)
N$16
  Top 0.406: IC18.8 30.11,73.05 R14.1
N$17
  Top 0.406: IC18.1 31.55,76.7 R14.2
N$18
  Top 0.406: U2.3 91.8,9.24 R17.2 89.8,9.22 89.8,8.2 89.14,7.54 R18.1
N$19
  Top 0.406: IC17.8 11.6,73.25 R267.1
N$20  (2 unrouted)
N$21  (via drill 0.6)
  Top 0.406: C41.1 27.3,79.15 27.47,79.32 | 27.47,79.32 C42.2 R16.2 27.45,82.85 v27.3,83 | IC18.3 27.56,79.23 27.47,79.32 | v25,86.7 26.25,86.7 R263.2
  Bottom 0.406: v27.3,83 27.3,84.4 v25,86.7
N$22
  Top 0.406: U5.3 36.84,14.98 C29.2
N$23  (1 unrouted)
N$24
  Top 0.406: IC19.8 39.41,73.25 R19.1
N$25
  Top 0.406: C61.2 22.3,2.1 | 22.3,2.1 PAD4.1 | U6.3 22.3,4.63 22.3,2.1 | C32.1 C33.1 IC5.IN IC4.IN
  Bottom 0.406: IC4.IN 29.68,3.81 C23.1 C24.1 26.16,4.1 PAD4.1
N$26
  Top 0.406: U6.5 20.46,7.14 21.3,6.3 23.55,6.3 R81.1
N$27
  Top 0.406: U6.2 21.4,5.6 21.7,5.7 23.2,5.7 23.8,5.3 24.35,5.3 R81.2
N$28
  Top 0.406: LED3.A R82.1
N$29
  Top 0.406: LED3.C 20.46,4.55 U6.1
N$30
  Top 0.406: IC19.1 40.95,76.8 R19.2
N$31  (4 unrouted)
N$32  (1 unrouted)
N$33  (1 unrouted)
N$34  (1 unrouted)
N$35  (1 unrouted)
N$36  (4 unrouted)
N$37  (1 unrouted)
N$38
  Top 0.406: U5.5 45.57,13.71 R29.2
N$39
  Top 0.406: C7.2 U1.20
N$40
  Top 0.406: U5.8 46.52,17.53 L2.1 48.1,17.56 D3.A
N$41
  Top 0.406: LED1.A R31.1
N$42
  Top 0.406: LED2.A R32.1
N$43  (2 unrouted)
N$44  (3 unrouted)
N$45
  Top 0.406: R34.1 14.92,36.57 LED4.A
N$46  (2 unrouted)
N$47  (2 unrouted)
N$48  (2 unrouted)
N$49  (1 unrouted)
N$50  (1 unrouted)
N$51  (1 unrouted)
N$52  (4 unrouted)
N$53  (1 unrouted)
N$54
  Top 0.406: IC17.1 13.15,76.7 R267.2
N$55  (3 unrouted)
N$56  (5 unrouted)
N$57  (2 unrouted)
N$58  (3 unrouted)
N$59  (2 unrouted)
N$60  (2 unrouted)
N$61  (2 unrouted)
N$62  (2 unrouted)
N$63  (2 unrouted)
N$64  (5 unrouted)
N$65  (5 unrouted)
N$66  (4 unrouted)
N$67  (4 unrouted)
N$68  (1 unrouted)
N$69  (1 unrouted)
N$70  (3 unrouted)
N$72  (2 unrouted)
N$73  (3 unrouted)
N$74  (2 unrouted)
N$75  (2 unrouted)
N$76  (2 unrouted)
N$77  (2 unrouted)
N$78  (2 unrouted)
N$80  (1 unrouted)
N$81  (1 unrouted)
N$82  (4 unrouted)
N$83  (1 unrouted)
N$84  (via drill 0.6)
  Top 0.406: IC17.3 9.06,78.78 C20.1 10.5,81.15 C21.2 R270.2 9.05,82.95 v9,82.9 | R265.2 8.1,86.4 v7.1,85.4
  Bottom 0.406: v7.1,85.4 7.1,84.8 v9,82.9
N$85  (1 unrouted)
N$86  (1 unrouted)
N$87  (2 unrouted)
N$88  (3 unrouted)
N$89  (2 unrouted)
N$90
  Top 0.406: IC17.2 10.33,78.88 C21.1 11.75,79.25 12.8,80.3 12.8,80.85 C22.2 12.75,82.9 R269.1 14.35,82.95 14.8,83.4 14.8,86.45 R87.2 R86.2 R85.2
N$91  (4 unrouted)
N$92  (2 unrouted)
N$93  (2 unrouted)
N$94
  Top 0.406: V6.1 R265.1
N$95  (4 unrouted)
N$96  (via drill 0.6)
  Top 0.406: IC6.2 19.63,78.88 C15.1 20.3,79.15 C16.2 21.95,82.8 R12.1 25.25,82.85 v25.3,82.9 | R90.2 R91.2 R92.2 v34,85.2
  Bottom 0.406: v25.3,82.9 25.8,82.9 26.9,81.8 30.6,81.8 v34,85.2
N$97
  Top 0.406: R264.1 V5.1
N$98  (via drill 0.6)
  Top 0.305: U4.2 3.73,8.28 v3.8,8.2 | U4.8 11.34,11.55 12.1,10.8 12.1,5.7 CON2.GND
  Bottom 0.305: C18.1 11,8.2 12.3,6.9 CON2.GND
  Bottom 0.406: v3.8,8.2 4.6,8.2 6.1,9.7 9.6,9.7 9.7,9.6 9.7,8.25 C18.1
N$99  (1 unrouted)
N$100  (2 unrouted)
N$101
  Top 0.406: R263.1 V4.1
N$102
  Top 0.305: R216.1 7.8,10.1 8.8,11.1 U4.6
N$103
  Top 0.305: U4.7 10.1,12.2 R215.1
N$104  (1 unrouted)
N$105  (3 unrouted)
  Top 0.406: IC18.2 28.84,78.96 28.6,79.2 29.15,79.2 C42.1 29.7,79.15 C43.2 31.25,82.8 R15.1
N$106  (6 unrouted)
N$107  (2 unrouted)
N$108  (2 unrouted)
N$109  (2 unrouted)
N$110  (2 unrouted)
N$111  (2 unrouted)
N$113  (1 unrouted)
N$114  (1 unrouted)
N$115  (4 unrouted)
N$116  (1 unrouted)
N$117  (1 unrouted)
N$118  (1 unrouted)
N$119  (1 unrouted)
N$120  (2 unrouted)
N$121  (3 unrouted)
N$122  (2 unrouted)
N$123
  Top 0.305: R216.2 CON2.D-
N$124
  Top 0.305: U4.10 10.07,27.93 R234.2
N$125  (4 unrouted)
N$126  (6 unrouted)
N$127  (2 unrouted)
N$128  (2 unrouted)
N$130  (1 unrouted)
N$131  (1 unrouted)
N$132  (1 unrouted)
N$133  (4 unrouted)
N$134  (1 unrouted)
N$135  (1 unrouted)
N$137  (2 unrouted)
N$138  (3 unrouted)
N$139  (2 unrouted)
N$140
  Top 0.305: CON2.D+ 9.8,5.6 10.1,5.9 R215.2
N$141
  Top 0.305: U4.11 R235.2
N$142  (1 unrouted)
N$143  (6 unrouted)
N$144  (1 unrouted)
N$145  (2 unrouted)
N$146  (2 unrouted)
N$147  (2 unrouted)
N$148  (2 unrouted)
N$149  (2 unrouted)
N$158  (2 unrouted)
N$159  (3 unrouted)
N$160  (2 unrouted)
N$161  (1 unrouted)
N$163  (2 unrouted)
N$164  (2 unrouted)
N$165  (2 unrouted)
N$166  (2 unrouted)
N$175  (2 unrouted)
N$176  (3 unrouted)
N$177  (2 unrouted)
N$180  (2 unrouted)
N$182  (2 unrouted)
N$183  (2 unrouted)
N$184  (2 unrouted)
N$193  (2 unrouted)
N$194  (3 unrouted)
N$195  (2 unrouted)
N$198  (2 unrouted)
N$208  (2 unrouted)
N$209  (3 unrouted)
N$210  (2 unrouted)
N$213  (2 unrouted)
N$214  (2 unrouted)
N$215  (2 unrouted)
N$216  (2 unrouted)
N$225  (2 unrouted)
N$226  (3 unrouted)
N$227  (2 unrouted)
N$231  (2 unrouted)
N$232  (2 unrouted)
N$233  (2 unrouted)
N$234  (2 unrouted)
N$243  (2 unrouted)
N$244  (3 unrouted)
N$245  (2 unrouted)
PGEC  (via drill 0.6)
  Top 0.406: SV1.2 25,52.7 v28.1,49.6 | v31.1,50 40.4,50 41.9,48.5 41.9,47.14 U1.5
  Bottom 0.406: v28.1,49.6 30.7,49.6 v31.1,50
PGED  (via drill 0.6)
  Top 0.406: SV1.3 24.56,55.24 v28.2,51.6
  Bottom 0.406: v28.2,51.6 31.6,51.6 32,51.2 37.8,51.2 39.6,49.4 39.6,47.18 U1.4
PLET_SIGNAL
  Top 0.406: R20.1 101.7,6.65 R21.2 99.46,6.7 U2.5
R_LEG_DRIVE
  Top 0.406: R253.2 100.8,10.5 | 100.8,10.5 100.7,10.5 U2.7 | U2.6 99.52,9.22 100.8,10.5
RA  (via drill 0.6)  (10 unrouted)
  Top 0.406: R87.1 v15.1,91.7 | v34,91.7 R92.1
  Bottom 0.406: v15.1,91.7 v34,91.7
RESET_WIFI  (via drill 0.6)
  Top 0.406: v61,40 60.9,40 59,38.1 36.6,38.1 v35.8,37.3 | v32.8,37.3 20.7,37.3 v20.4,37.6
  Bottom 0.406: U1.14 64.86,43.86 v61,40 | v35.8,37.3 v32.8,37.3 | v20.4,37.6 17.5,37.6 13.3,33.4 10.1,33.4 8.1,35.4 SV2.5
RX_WIFI  (via drill 0.6)
  Top 0.406: U1.17 59.78,59.12 55.8,63.1 v18.2,63.1 | v18.2,49.9 10.7,42.4 10.7,41.06 SV2.8
  Bottom 0.406: v18.2,63.1 v18.2,49.9
SHDN_AN  (via drill 0.6)
  Top 0.406: U5.1 38.4,17.53 v38.4,21.3 | v40.9,39.3 43.2,39.3 48.2,44.3 48.2,48.4 v51.6,51.8
  Bottom 0.406: v38.4,21.3 38.4,22.3 40.9,24.8 v40.9,39.3 | v51.6,51.8 55.2,51.8 57.3,53.9 57.3,54.6 U1.18
TX_WIFI  (via drill 0.6)
  Top 0.406: SV2.1 2.15,38.45 1.4,39.2 1.4,45.2 4.5,48.3 8.7,48.3 v10.3,49.9 | v10.4,61.7 47.6,61.7 v47.8,61.5 | U1.16 62.32,60.78 v61.6,61.5
  Bottom 0.406: v10.3,49.9 10.3,61.6 v10.4,61.7 | v47.8,61.5 v61.6,61.5
VBUS  (via drill 0.6)
  Top 0.305: CON2.VBUS 5.3,6.4 6.27,7.36 U4.4 6.3,12.24 6.3,13.7 5.8,14.2 5,14.2 | U4.1 2.46,13.65 3,14.2 5,14.2 | U4.3 5,14.2
  Top 0.406: U6.4 22.34,9.71 | 22.34,9.71 C60.2 22.25,9.7 20.9,9.7 19.65,10.95 R82.2 16.55,10.95 13.7,8.1 13.7,4.9 12.4,3.6 7.2,3.6 CON2.VBUS | 22.34,9.71 v27.89,9.71 v27.9,9.7 | v29.3,25.9 29.3,31.6 v32.8,35.1 | v35.6,35.1 58.9,35.1 v59.2,35.4 | v62.4,35.9 62.6,35.9 68,41.3 68,51.52 U1.15
  Bottom 0.406: C18.2 8,8.2 CON2.VBUS | v27.9,9.7 27.9,24.5 v29.3,25.9 | v32.8,35.1 v35.6,35.1 | v59.2,35.4 61.9,35.4 v62.4,35.9
VCC  (via drill 0.6)  (33 unrouted)
  Top 0.406: D3.C 49.99,12.31 47.3,15 43.57,15 U5.6 41.92,14.98 40.7,16.2 40.4,16.2 | 40.4,16.2 38.68,16.2 U5.2 | U2.8 96.1,14.3 93.9,16.5 90.5,16.5 87.9,13.9 87.9,9.26 R17.1 | C31.2 40.4,19.54 40.4,16.2 | C138.1 10.33,69.28 IC17.7 10.4,71.56 v10.4,74.2 | v15,73.3 v19,73.3 19.63,72.66 IC6.7 19.63,69.21 C36.1 | v28.4,73.3 28.84,72.86 IC18.7 28.8,71.46 C49.1 | C58.1 38.2,71.53 IC19.7 | C64.1 47.5,71.66 IC20.7 | C73.1 56.9,71.66 IC21.7
  Bottom 0.406: v15,73.3 11.3,73.3 v10.4,74.2 | v28.4,73.3 v19,73.3
VIN  (via drill 0.6)
  Top 0.406: 32.34,18.16 R31.2 32.36,15.4 R32.2 33.68,13.22 v33.7,13.2 | 32.34,18.16 R30.2 32.04,18.46 C30.2 26.14,18.46 24.7,19.9 24.7,25.4 22.3,27.8 18.6,27.8 R3.2 18.42,27.98 C6.2 L1.2 | 32.34,18.16 33.46,18.16 34.7,19.4 34.7,20.9 36.8,23 45.01,23 L2.2
  Bottom 0.406: v33.7,13.2 33.7,11.04 IC4.OUT
VIN_WIFI  (via drill 0.6)
  Top 0.406: C35.1 45.47,8.8 C34.1 42.18,8.86 IC5.OUT | SV2.7 12.99,38.45 R34.2 13.02,39.62 13.7,40.3 16,40.3 17,39.3 17,36.3 v30.9,22.4
  Bottom 0.406: v30.9,22.4 30.9,20.14 IC5.OUT
XTAL_IN
  Top 0.406: U1.9 Q2.2 | Q2.2 51.7,44.19 C27.1 | R28.2 52.54,43.82 Q2.2
XTAL_OUT
  Top 0.406: U1.10 Q2.1 | Q2.1 55.3,44.19 C28.1 | R28.1 54.44,43.92 Q2.1